# EAGLE design esp8266-pcb (EAGLE 6.4)
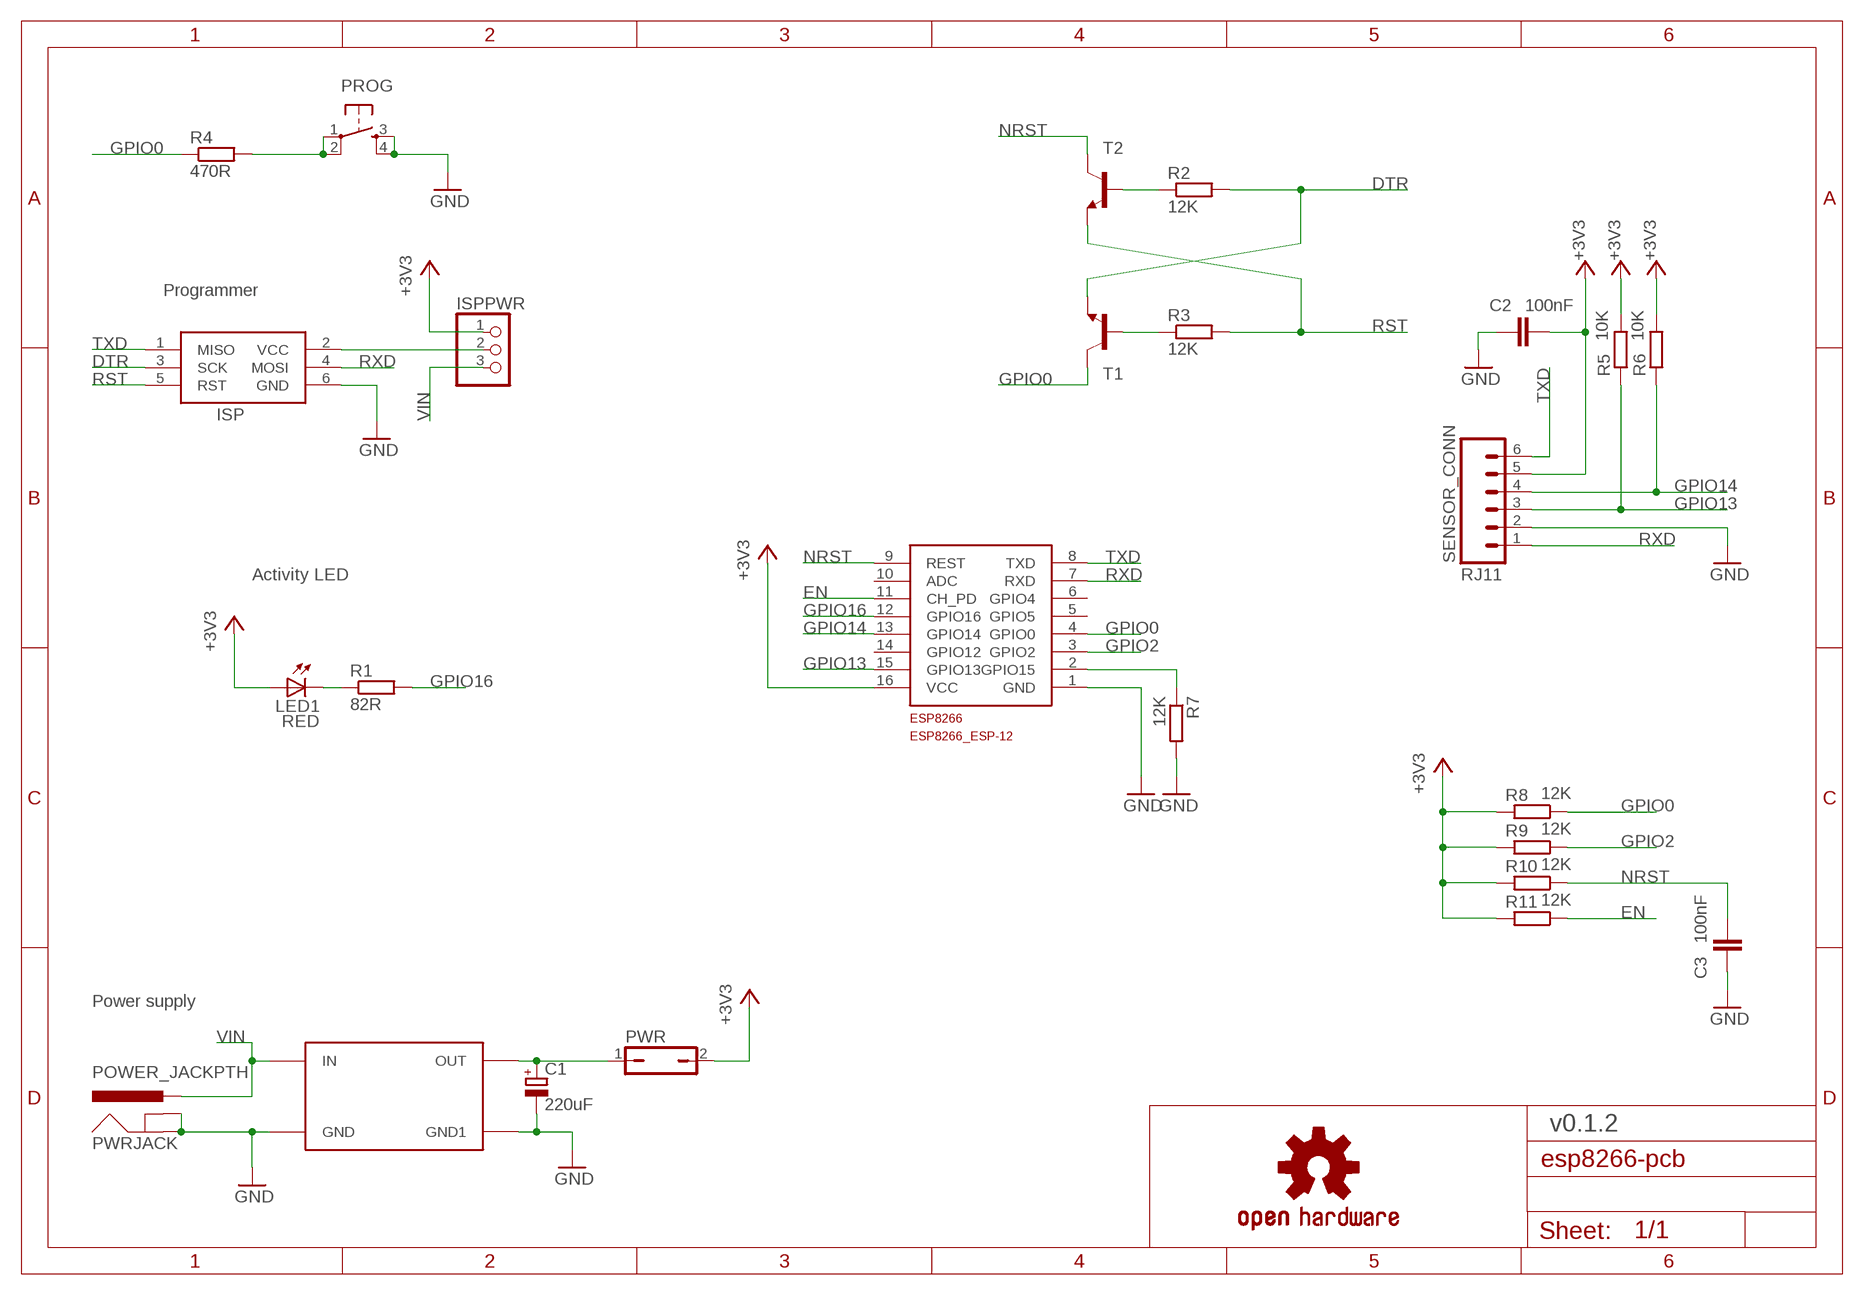
[diagram p0: schematic, sheet 1]

## Parts
C1  220uF  CPOL-EUE2.5-6  [E2,5-6]
C2  100nF  C-EUC0805  [C0805]
C3  100nF  C-EUC0805  [C0805]
ESP8266  ESP8266_ESP-12  [ESP8266-ESP12]
ISP  AVRISP-6  [AVRISP]
ISPPWR  PINHD-1X3  [1X03]
LED1  RED  LEDSMT1206  [1206]
PROG  TAC_SWITCHPTH  [TACTILE-PTH]
PWR  JP1Q  [JP1]
PWRJACK  POWER_JACKPTH  [POWER_JACK_PTH]
R1  82R  R-EU_R0805  [R0805]
R2  12K  R-EU_R0805  [R0805]
R3  12K  R-EU_R0805  [R0805]
R4  470R  R-EU_R0805  [R0805]
R5  10K  R-EU_R0805  [R0805]
R6  10K  R-EU_R0805  [R0805]
R7  12K  R-EU_R0805  [R0805]
R8  12K  R-EU_R0805  [R0805]
R9  12K  R-EU_R0805  [R0805]
R10  12K  R-EU_R0805  [R0805]
R11  12K  R-EU_R0805  [R0805]
SENSOR_CONN  RJ11  RJ11-6PTH  [RJ11-6]
T1  BC808-NPN-SOT23-BEC  [SOT23-BEC]
T2  BC808-NPN-SOT23-BEC  [SOT23-BEC]
U$1  OSHW-LOGOL  [OSHW-LOGO-L]
U$2  DC-DC-SMALL  [DC-DC]

## Nets
+3V3: C2.2 ESP8266.16(VCC) ISPPWR.1 LED1.A PWR.2 R5.2 R6.2 R8.2 R9.2 R10.2 R11.2 SENSOR_CONN.5
DTR: ISP.3(SCK) R2.2 T1.E
EN: ESP8266.11(CH_PD) R11.1
GND: C1.- C2.1 C3.1 ESP8266.1(GND) ISP.6(GND) PROG.3 PROG.4 PWRJACK.GND PWRJACK.GNDBREAK R7.2 SENSOR_CONN.2 U$2.P$3(GND) U$2.P$4(GND1)
GPIO0: ESP8266.4(GPIO0) R4.1 R8.1 T1.C
GPIO2: ESP8266.3(GPIO2) R9.1
GPIO13: ESP8266.15(GPIO13) R5.1 SENSOR_CONN.3
GPIO14: ESP8266.13(GPIO14) R6.1 SENSOR_CONN.4
GPIO16: ESP8266.12(GPIO16) R1.2
N$1: LED1.C R1.1
N$2: C1.+ PWR.1 U$2.P$2(OUT)
N$3: R2.1 T2.B
N$4: PROG.1 PROG.2 R4.2
N$5: ESP8266.2(GPIO15) R7.1
N$6: ISP.2(VCC) ISPPWR.2
N$7: R3.1 T1.B
NRST: C3.2 ESP8266.9(REST) R10.1 T2.C
RST: ISP.5(RST) R3.2 T2.E
RXD: ESP8266.7(RXD) ISP.4(MOSI) SENSOR_CONN.1
TXD: ESP8266.8(TXD) ISP.1(MISO) SENSOR_CONN.6
VIN: ISPPWR.3 PWRJACK.PWR U$2.P$1(IN)
Unconnected: ESP8266.5(GPIO5) ESP8266.6(GPIO4) ESP8266.10(ADC) ESP8266.14(GPIO12)

## Notes on the sheet
- Programmer
- Activity LED
- Power supply
- v0.1.2

## Library data of the parts
C1 = rcl:CPOL-EU: POLARIZED CAPACITOR, European symbol
C2 C3 = rcl:C-EU: CAPACITOR, European symbol
ESP8266 = ESP8266-ESP12:ESP8266_ESP-12
ISP = adafruit:AVRISP: AVR ISP HEADER Standard 6 pin header for AVR programming
ISPPWR = pinhead:PINHD-1X3: PIN HEADER
LED1 = led:LED: LED OSRAM: - CHIPLED LG R971, LG N971, LY N971, LG Q971, LY Q971, LO R971, LY R971 LH N974, LH R974 LS Q976, LO Q976, LY Q976 LO Q996 - Hyper CHIPLED LW Q18S LB Q993, LB Q99A, LB R99A - SideLED LS A670, LO A670, LY A670, LG A670, LP A670 LB A673, LV A673, LT A673, LW A673 LH A674 LY A675 LS A676, LA A676, LO A676, LY A676, LW A676 LS A679, LY A679, LG A679 - Hyper Micro SIDELED® LS Y876, LA Y876, LO Y876, LY Y876 LT Y87S - SmartLED LW L88C, LW L88S LB L89C, LB L89S, LG L890 LS L89K, LO L89K, LY L89K LS L896, LA L896, LO L896, LY L896 - TOPLED LS T670, LO T670, LY T670, LG T670, LP T670 LSG T670, LSP T670, LSY T670, LOP T670, LYG T670 LG T671, LOG T671, LSG T671 LB T673, LV T673, LT T673, LW T673 LH T674 LS T676, LA T676, LO T676, LY T676, LB T676, LH T676, LSB T676, LW T676 LB T67C, LV T67C, LT T67C, LS T67K, LO T67K, LY T67K, LW E67C LS E67B, LA E67B, LO E67B, LY E67B, LB E67C, LV E67C, LT E67C LW T67C LS T679, LY T679, LG T679 LS T770, LO T770, LY T770, LG T770, LP T770 LB T773, LV T773, LT T773, LW T773 LH T774 LS E675, LA E675, LY E675, LS T675 LS T776, LA T776, LO T776, LY T776, LB T776 LHGB T686 LT T68C, LB T68C - Hyper Mini TOPLED® LB M676 - Mini TOPLED Santana® LG M470 LS M47K, LO M47K, LY M47K Source: http://www.osram.convergy.de LUXEON: - LUMILED® LXK2-PW12-R00, LXK2-PW12-S00, LXK2-PW14-U00, LXK2-PW14-V00 LXK2-PM12-R00, LXK2-PM12-S00, LXK2-PM14-U00 LXK2-PE12-Q00, LXK2-PE12-R00, LXK2-PE12-S00, LXK2-PE14-T00, LXK2-PE14-U00 LXK2-PB12-K00, LXK2-PB12-L00, LXK2-PB12-M00, LXK2-PB14-N00, LXK2-PB14-P00, LXK2-PB14-Q00 LXK2-PR12-L00, LXK2-PR12-M00, LXK2-PR14-Q00, LXK2-PR14-R00 LXK2-PD12-Q00, LXK2-PD12-R00, LXK2-PD12-S00 LXK2-PH12-R00, LXK2-PH12-S00 LXK2-PL12-P00, LXK2-PL12-Q00, LXK2-PL12-R00 Source: www.luxeon.com KINGBRIGHT: KA-3528ASYC Source: www.kingbright.com
PROG = SparkFun-Retired:TAC_SWITCH: Momentary Switch Button commonly used for reset or general input. Spark Fun Electronics SKU : COM-00097 SMT- SWCH-08247
PWR = jumper:JP1Q: JUMPER
PWRJACK = SparkFun-Connectors:POWER_JACK: Power Jack This is the standard 5.5mm barrel jack for power. The PTH is the most common, proven, reliable, footprint. The Slot footprint only works if the mill layer is transmitted to the PCB fab house so be warned. Mating wall wart : TOL-00298 (and others); PROD_ID: CONN-08197
R1-R11 = rcl:R-EU_: RESISTOR, European symbol
SENSOR_CONN = SparkFun-Connectors:RJ11-6: RJ11 Jack Simple 6 pin RJ11 jack. Commonly found on CAT3 devices and Microchip programmers. SKU: PRT-00132; PROD_ID: CONN-08590
T1 T2 = transistor:*-NPN-: NPN Transistror BF959 corrected 2008.03.06
U$1 = SparkFun:OSHW-LOGO: Open Source Hardware Logo This logo indicates the piece of hardware it is found on incorporates a OSHW license and/or adheres to the definition of open source hardware found here: http://freedomdefined.org/OSHW
U$2 = OK1CDJ-E6:DC-DC-SMALL

## Board
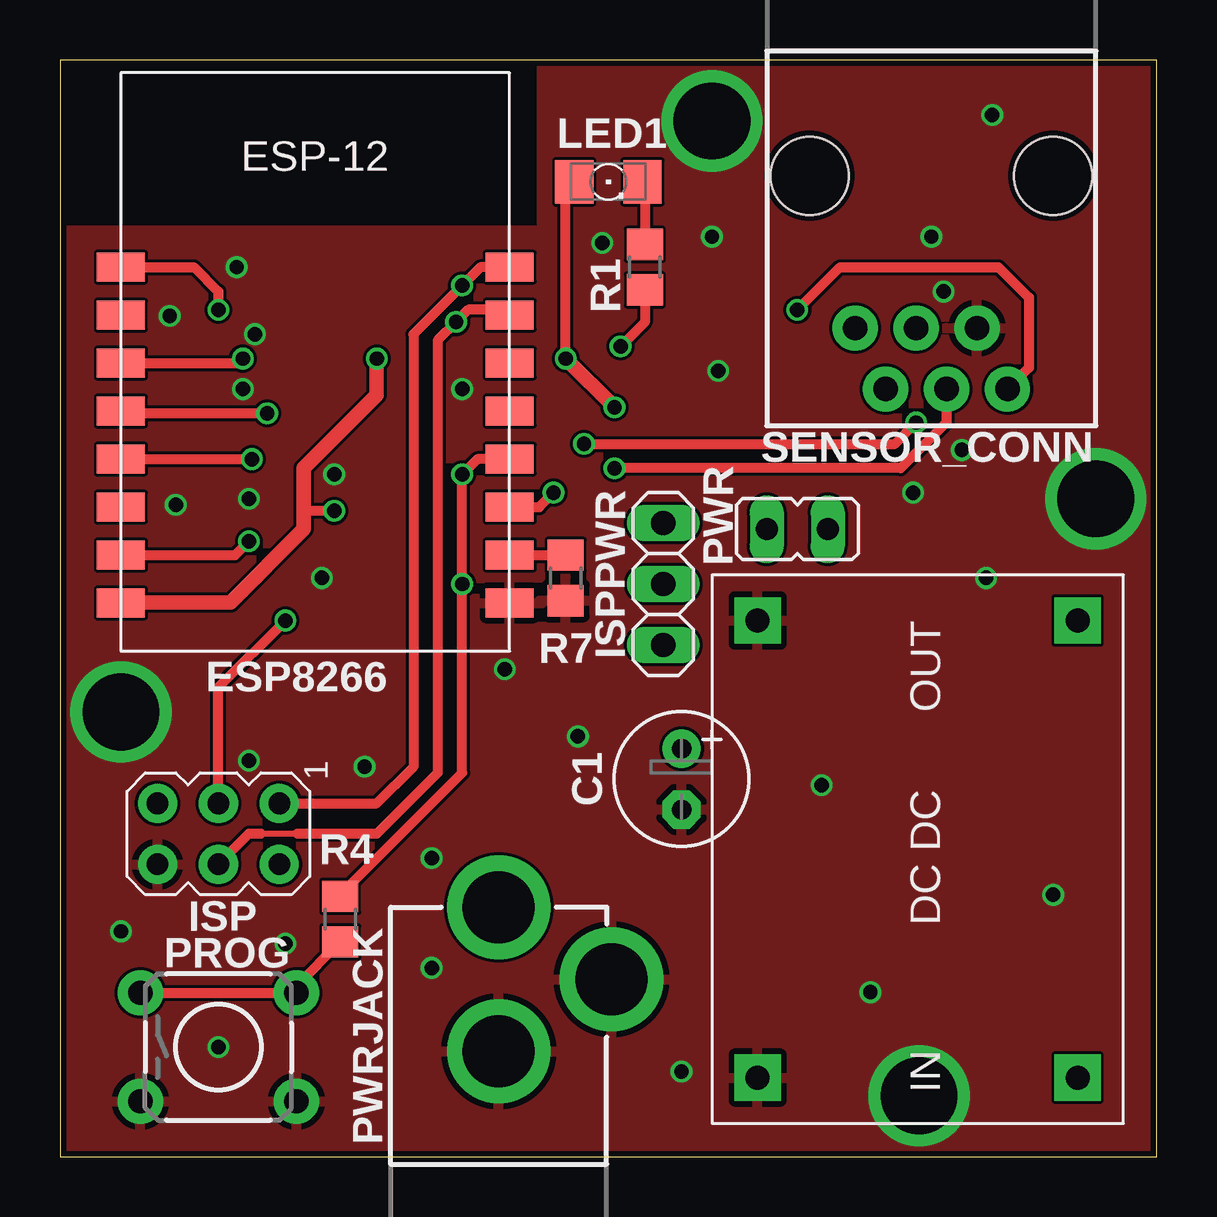
[diagram p1: board, top side]
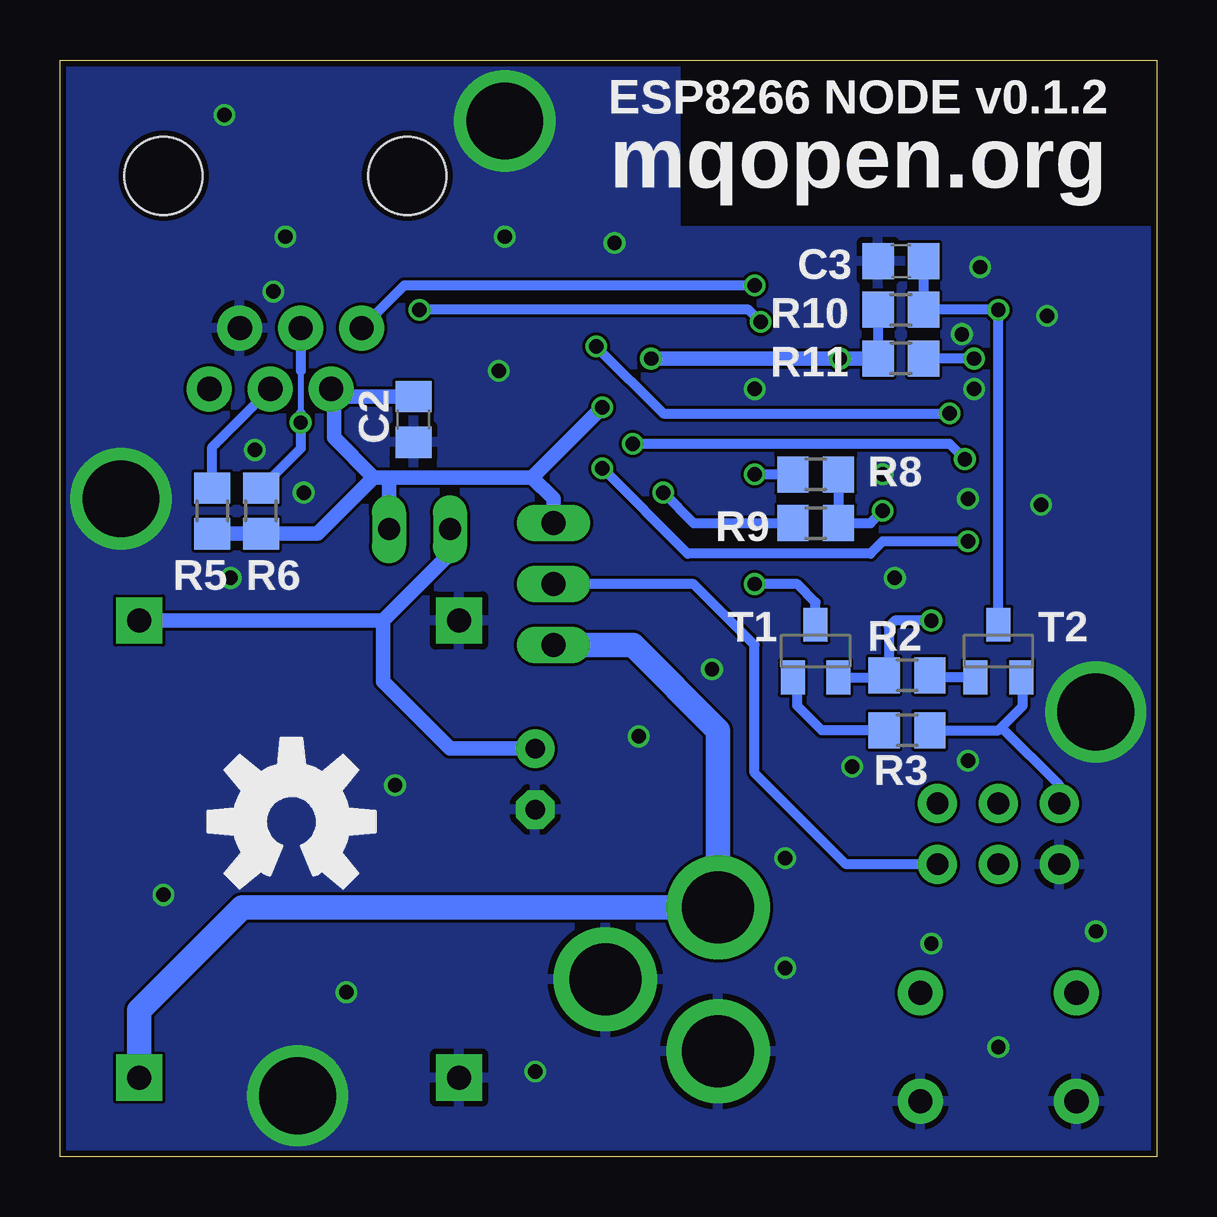
[diagram p2: board, bottom side, seen from below]

Size 45.72 x 45.72 mm. Coordinates in mm from the lower left corner, seen from the top.
Outline: 0,0 45.72,0 45.72,45.72 0,45.72 0,0
Copper layers (1*16): Top 0.035mm / dielectric 1.5mm / Bottom 0.035mm
Design rules "dirt_cheap_dirty_boards.v1": minimum track width 5mil, minimum drill 12mil, track to track 5mil, track to pad 5mil, pad to pad 5mil, via to via 5mil, smd to smd 0mil, copper to edge 10mil, drill to drill 10mil, minimum pad ring 10mil, minimum via ring 6mil, stop-mask expansion 2mil, vias tented up to drill 25mil, thermal gap 10mil

### Footprints (pad centres in the part's own frame; a part is rotated, then mirrored left to right if it is on the bottom)
E2,5-6 = drill 0.813 pad 1.6: + -1.27,0 | drill 0.813 pad 1.6 octagon: - 1.27,0
C0805 = smd 1.3 x 1.5: 1 -0.95,0; 2 0.95,0
ESP8266-ESP12 = smd 2 x 1.2: 1 16.2,2; 2 16.2,4; 3 16.2,6; 4 16.2,8; 5 16.2,10; 6 16.2,12; 7 16.2,14; 8 16.2,16; 9 0,16; 10 0,14; 11 0,12; 12 0,10; 13 0,8; 14 0,6; 15 0,4; 16 0,2
AVRISP = drill 0.9 pad 1.626: 1 -1.27,2.54; 2 1.27,2.54; 3 -1.27,0; 4 1.27,0; 5 -1.27,-2.54; 6 1.27,-2.54
1X03 = drill 1.016 long: 1 -2.54,0; 2 0,0; 3 2.54,0
1206 = smd 1.6 x 1.803: A -1.422,0; C 1.422,0
TACTILE-PTH = drill 1.016 pad 1.88: 1 -3.251,2.261; 2 3.251,2.261; 3 -3.251,-2.261; 4 3.251,-2.261
JP1 = drill 0.914 long: 1 0,-1.27; 2 0,1.27
POWER_JACK_PTH = drill 2.997 pad 4.318: GND 0,7.7; GNDBREAK 4.7,10.7; PWR 0,13.7
R0805 = smd 1.3 x 1.5: 1 -0.95,0; 2 0.95,0
RJ11-6 = drill 1.016 pad 1.88: 1 -3.175,8.89; 2 -1.905,6.35; 3 -0.635,8.89; 4 0.635,6.35; 5 1.905,8.89; 6 3.175,6.35 | hole 3.251: -5.08,0; 5.08,0
SOT23-BEC = smd 1 x 1.4: B -0.95,-1.1; C 0,1.1; E 0.95,-1.1
DC-DC = drill 1 pad 1.93 square: P$1 1.27,1.27; P$2 20.32,1.27; P$3 1.27,14.605; P$4 20.32,14.605

### Placement (x,y rotation side)
C1  25.91,15.75 270 top
C2  30.99,30.73 90 bottom
C3  10.67,37.34 0 bottom
ESP8266  2.54,21.08 0 top
ISP  6.6,13.46 270 top
ISPPWR  25.15,23.88 270 top
LED1  22.86,40.64 0 top
PROG  6.6,4.57 0 top
PWR  30.73,26.16 270 top
PWRJACK  18.29,-3.3 0 top
R1  24.38,37.08 270 top
R2  10.41,20.07 180 bottom
R3  10.41,17.78 0 bottom
R4  11.68,9.91 270 top
R5  39.37,26.92 270 bottom
R6  37.34,26.92 270 bottom
R7  21.08,24.13 270 top
R8  14.22,28.45 0 bottom
R9  14.22,26.42 0 bottom
R10  10.67,35.31 180 bottom
R11  10.67,33.27 180 bottom
SENSOR_CONN  36.32,40.89 180 top
T1  14.22,21.08 0 bottom
T2  6.6,21.08 0 bottom
U$1  36.07,13.97 0 bottom
U$2  43.69,2.03 90 top

### Tracks (layer width: path | path; a pad name or v marks a point on that pad's centre or on a via)
+3V3  (via drill 0.6)
  Top 0.406: v21.08,33.27 21.08,40.28 LED1.A | v11.43,26.92 10.41,26.92 10.16,27.18
  Top 0.61: v23.11,31.24 v21.08,33.27 | 21.08,40.13 LED1.A | ESP8266.16 2.57,23.11 7.11,23.11 10.16,26.16 10.16,27.18 10.16,28.7 13.21,31.75 v13.21,33.27
  Bottom 0.406: R8.2 R9.2 11.94,26.42 v11.43,26.92 | R10.2 R11.2
  Bottom 0.61: 32.64,28.32 34.99,25.97 R6.2 R5.2 | 26.04,28.32 v23.11,31.24 | 26.04,28.32 32,28.32 | 32,28.32 32.64,28.32 | 32.64,28.32 34.29,29.97 34.29,31.88 SENSOR_CONN.5 34.1,31.68 C2.2 | PWR.2 32,28.32 | ISPPWR.1 25.15,27.43 26.04,28.32 | v21.08,33.27 v13.21,33.27 R11.2
DTR  (via drill 0.6)
  Top 0.406: ISP.3 6.6,19.56 v9.4,22.35
  Bottom 0.406: T1.E 11.36,19.98 R2.2 11.18,20.25 11.18,22.1 10.92,22.35 v9.4,22.35
EN  (via drill 0.6)
  Top 0.406: ESP8266.11 7.43,33.08 v7.62,33.27
  Bottom 0.406: v7.62,33.27 R11.1
GND  (via drill 0.6, 3.2)
  other vias: 27.18,43.18 43.18,27.43 35.81,2.54 2.54,18.54 16.76,32 4.57,35.05 7.37,37.08 27.18,38.35 36.83,36.07 35.56,27.69 37.59,29.46 38.61,24.13 31.75,15.49 41.4,10.92 33.78,6.86 25.91,3.56 15.49,7.87 9.4,8.89 12.7,16.26 7.87,16.51 4.83,27.18 10.92,24.13 15.49,12.45 21.59,17.53 22.61,38.1 2.54,9.4 38.86,43.43 7.87,27.43 11.43,28.45 18.54,20.32 36.32,38.35 6.6,4.57 7.62,32 8.13,34.29 27.43,32.77
  pour Bottom: -0.25,38.61 -0.25,-0.25 45.97,-0.25 45.97,45.97 20.07,45.97 20.07,38.61
  pour Top: -0.25,38.61 -0.25,-0.25 45.97,-0.25 45.97,45.97 20.07,45.97 20.07,38.61
GPIO0  (via drill 0.6)
  Top 0.406: ESP8266.4 17.4,29.08 v16.76,28.45 16.76,28.19 v16.76,23.88 16.76,16 12.19,11.43 12.19,11.36 R4.1
  Bottom 0.406: T1.C 14.22,23.11 14.99,23.88 v16.76,23.88 | R8.1 v16.76,28.45
GPIO2  (via drill 0.6)
  Top 0.406: ESP8266.3 19.97,27.08 v20.57,27.69
  Bottom 0.406: v20.57,27.69 19.3,26.42 R9.1
GPIO13  (via drill 0.6)
  Top 0.406: SENSOR_CONN.3 36.96,30.61 35.05,28.7 v23.11,28.7 | ESP8266.15 7.3,25.08 v7.87,25.65
  Bottom 0.406: SENSOR_CONN.3 39.37,29.59 R5.1 | v7.87,25.65 11.43,25.65 11.94,25.15 19.56,25.15 v23.11,28.7
GPIO14  (via drill 0.6)
  Top 0.406: ESP8266.13 v8,29.08 | v21.84,29.72 34.8,29.72 v35.69,30.61
  Bottom 0.254: 35.69,32.77 35.69,30.99
  Bottom 0.406: SENSOR_CONN.4 35.69,32.77 | R6.1 35.69,29.52 v35.69,30.61 35.69,30.99 | v8,29.08 8.64,29.72 v21.84,29.72
GPIO16  (via drill 0.6)
  Top 0.406: R1.2 24.38,34.8 v23.37,33.78 | v8.64,30.99 2.63,30.99 ESP8266.12
  Bottom 0.406: v23.37,33.78 20.57,30.99 v8.64,30.99
N$1
  Top 0.406: LED1.C 24.38,40.64 R1.1
N$2
  Bottom 0.61: U$2.P$2 32.26,22.35 | 32.26,22.35 29.46,25.15 PWR.1 | 32.26,22.35 32.26,19.81 29.46,17.02 C1.+
N$3
  Bottom 0.406: T2.B 9.46,19.98 R2.1
N$4
  Top 0.406: R4.2 9.86,7.13 PROG.2 PROG.1
N$5
  Top 0.406: ESP8266.2 R7.1
N$6
  Bottom 0.406: ISP.2 12.95,12.19 16.76,16 16.76,21.34 19.3,23.88 ISPPWR.2
N$7
  Bottom 0.406: R3.1 13.97,17.78 14.99,18.8 14.99,19.79 T1.B
NRST  (via drill 0.6)
  Top 0.406: ESP8266.9 5.59,37.08 6.6,36.07 v6.6,35.31
  Bottom 0.406: T2.C v6.6,35.31 R10.1 C3.2
RST
  Bottom 0.406: 6.48,17.91 6.6,17.78 R3.2 9.4,17.71 | 6.48,17.91 5.59,18.8 5.59,19.92 T2.E | ISP.5 4.06,15.49 6.48,17.91
RXD  (via drill 0.6)
  Top 0.254: 9.91,13.46 8.38,13.46
  Top 0.406: ESP8266.7 18.74,35.25 18.8,35.31 17.02,35.31 v16.51,34.8 15.75,34.04 15.75,16 13.21,13.46 9.91,13.46 | v30.73,35.31 32.51,37.08 39.12,37.08 40.39,35.81 40.39,32.89 SENSOR_CONN.1 | 8.38,13.46 7.87,13.46 ISP.4
  Bottom 0.406: v16.51,34.8 17.02,35.31 v30.73,35.31
TXD  (via drill 0.6)
  Top 0.406: ESP8266.8 17.52,37.08 v16.76,36.32 14.73,34.29 14.73,16.26 13.21,14.73 ISP.1
  Bottom 0.406: v16.76,36.32 31.37,36.32 SENSOR_CONN.6
VIN
  Bottom 1.016: U$2.P$1 42.42,6.1 38.12,10.4 PWRJACK.PWR 18.29,17.78 21.84,21.34 ISPPWR.3

### Text on the board
bNames: ESP8266 NODE v0.1.2 | mqopen.org